# Altium project PWM_Controller.PrjPcb
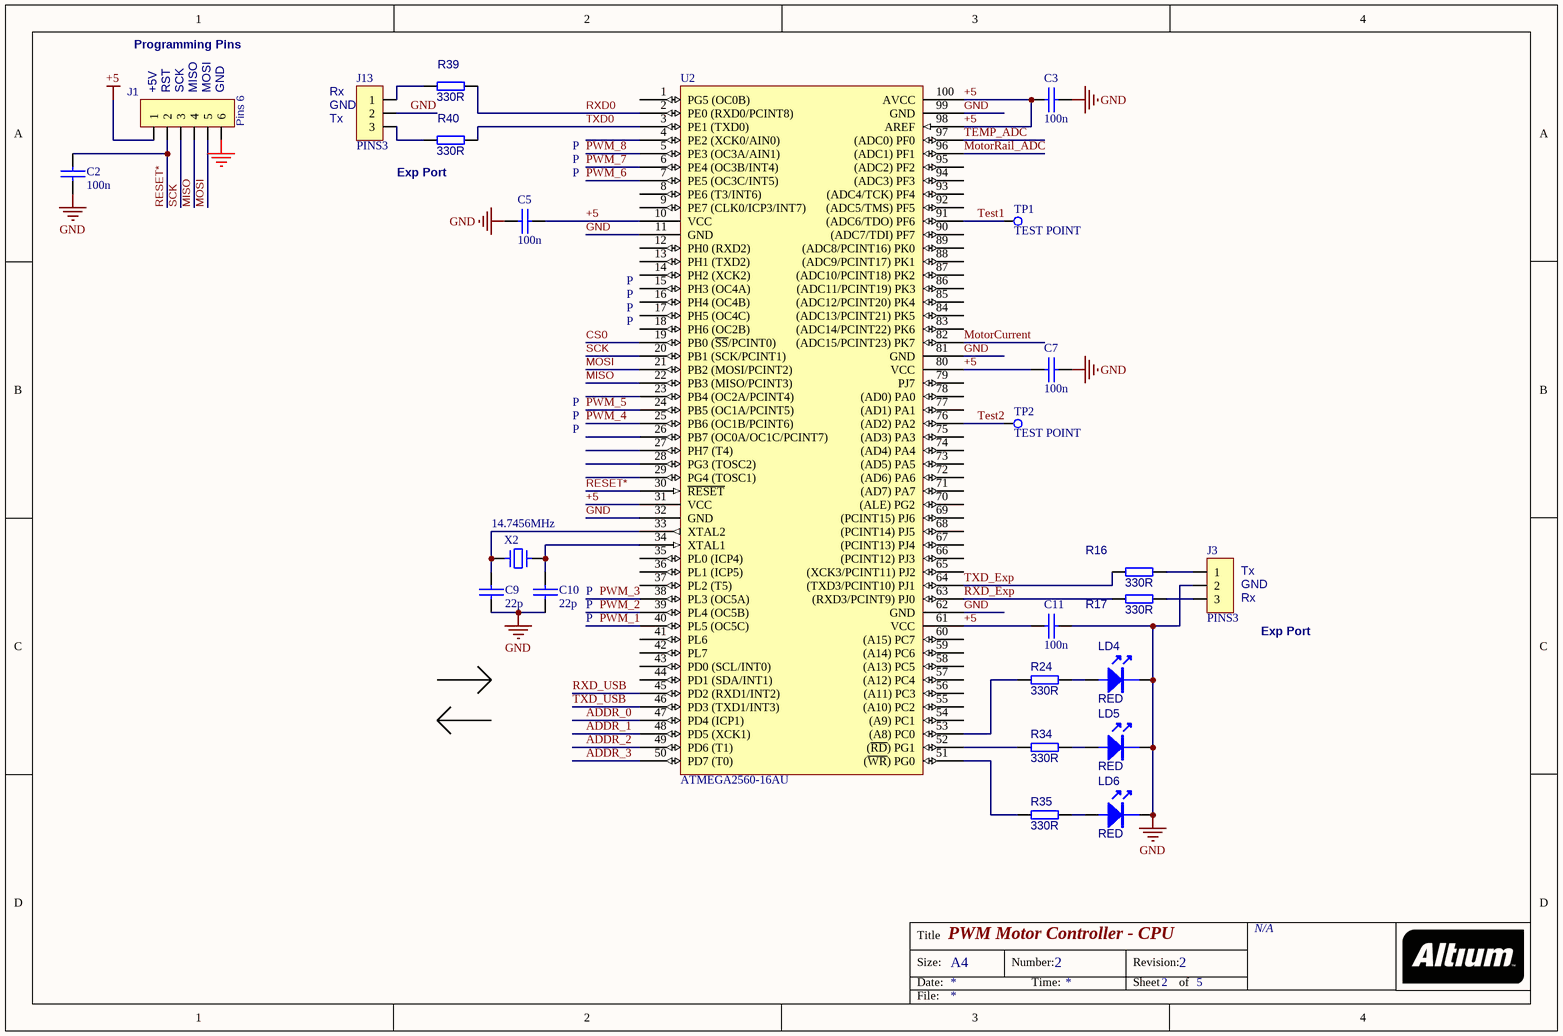
[diagram p0: PWM_CON_CPU.SchDoc]
5 sheets, 119 parts. Net scope: global (net labels, ports and power ports of the same name join across sheets).
Board file: PWM_Controller.PcbDoc
Sheets:
  PWM_CON_CPU.SchDoc
  PWM_CON_Outputs.SchDoc
  PWM_CON_PowerSupply.SchDoc
  PWM_CON_Sensors.SchDoc
  PWM_CON_USB.SchDoc

## Sheet PWM_CON_CPU.SchDoc: PWM Motor Controller - CPU
size A4; DocumentNumber: 2; Revision: 2; SheetNumber: 2; SheetTotal: 5; DrawnBy: T. Burns; Organization: N/A; ProjectName: PWM Motor Controller

### Parts
C2  100n  [0603]
C3  100n  [0603]
C5  100n  [0603]
C7  100n  [0603]
C9  22p  [0603]
C10  22p  [0603]
C11  100n  [0603]
J1  Pins 6  [SIP6]
J3  PINS3  [SIP3]
J13  PINS3  [SIP3]
LD4  RED  [0805DIODE]
LD5  RED  [0805DIODE]
LD6  RED  [0805DIODE]
R16  330R  [0603]
R17  330R  [0603]
R24  330R  [0603]
R34  330R  [0603]
R35  330R  [0603]
R39  330R  [0603]
R40  330R  [0603]
TP1  TEST POINT  [TEST POINT]
TP2  TEST POINT  [TEST POINT]
U2  ATMEGA2560-16AU  [100T1_N]
X2  14.7456MHz  [XTAL-V2]

### Nets
+5: C3.2 C5.1 C7.2 C11.2 J1.1 U2.10(VCC) U2.31(VCC) U2.61(VCC) U2.80(VCC) U2.98(AREF) U2.100(AVCC)
GND: C2.1 C3.1 C5.2 C7.1 C9.2 C10.2 C11.1 J1.6 J3.2 J13.2 LD4.K LD5.K LD6.K U2.11(GND) U2.32(GND) U2.62(GND) U2.81(GND) U2.99(GND)
ADDR_0: U2.47(PD4_(ICP1))
ADDR_1: U2.48(PD5_(XCK1))
ADDR_2: U2.49(PD6_(T1))
ADDR_3: U2.50(PD7_(T0))
CS0: U2.19(PB0_(~{SS}/PCINT0))
MISO: J1.4 U2.22(PB3_(MISO/PCINT3))
MOSI: J1.5 U2.21(PB2_(MOSI/PCINT2))
MotorCurrent: U2.82((ADC15/PCINT23)_PK7)
MotorRail_ADC: U2.96((ADC1)_PF1)
PWM_1: U2.40(PL5_(OC5C))
PWM_2: U2.39(PL4_(OC5B))
PWM_3: U2.38(PL3_(OC5A))
PWM_4: U2.25(PB6_(OC1B/PCINT6))
PWM_5: U2.24(PB5_(OC1A/PCINT5))
PWM_6: U2.7(PE5_(OC3C/INT5))
PWM_7: U2.6(PE4_(OC3B/INT4))
PWM_8: U2.5(PE3_(OC3A/AIN1))
RESET*: C2.2 J1.2 U2.30(~{RESET})
RXD0: R39.2 U2.2(PE0_(RXD0/PCINT8))
RXD_Exp: R17.1 U2.63((RXD3/PCINT9)_PJ0)
RXD_USB: U2.45(PD2_(RXD1/INT2))
SCK: J1.3 U2.20(PB1_(SCK/PCINT1))
TEMP_ADC: U2.97((ADC0)_PF0)
Test1: TP1.1 U2.91((ADC6/TDO)_PF6)
Test2: TP2.1 U2.76((AD2)_PA2)
TXD0: R40.2 U2.3(PE1_(TXD0))
TXD_Exp: R16.1 U2.64((TXD3/PCINT10)_PJ1)
TXD_USB: U2.46(PD3_(TXD1/INT3))
NetC9_1: C9.1 U2.33(XTAL2) X2.2
NetC10_1: C10.1 U2.34(XTAL1) X2.1
NetJ3_1: J3.1 R16.2
NetJ3_3: J3.3 R17.2
NetJ13_1: J13.1 R39.1
NetJ13_3: J13.3 R40.1
NetLD4_A: LD4.A R24.2
NetLD5_A: LD5.A R34.2
NetLD6_A: LD6.A R35.2
NetR24_1: R24.1 U2.53((A8)_PC0)
NetR34_1: R34.1 U2.52((~{RD})_PG1)
NetR35_1: R35.1 U2.51((~{WR})_PG0)

Not connected (* = marked no-connect by the designer): U2 1(PG5_(OC0B)) 4(PE2_(XCK0/AIN0)) 8(PE6_(T3/INT6)) 9(PE7_(CLK0/ICP3/INT7)) 12(PH0_(RXD2)) 13(PH1_(TXD2)) 14(PH2_(XCK2)) 15(PH3_(OC4A)) 16(PH4_(OC4B)) 17(PH5_(OC4C)) 18(PH6_(OC2B)) 23(PB4_(OC2A/PCINT4)) 26(PB7_(OC0A/OC1C/PCINT7)) 27(PH7_(T4)) 28(PG3_(TOSC2)) 29(PG4_(TOSC1)) 35(PL0_(ICP4)) 36(PL1_(ICP5)) 37(PL2_(T5)) 41(PL6) 42(PL7) 43(PD0_(SCL/INT0)) 44(PD1_(SDA/INT1)) 54((A9)_PC1) 55((A10)_PC2) 56((A11)_PC3) 57((A12)_PC4) 58((A13)_PC5) 59((A14)_PC6) 60((A15)_PC7) 65((XCK3/PCINT11)_PJ2) 66((PCINT12)_PJ3) 67((PCINT13)_PJ4) 68((PCINT14)_PJ5) 69((PCINT15)_PJ6) 70((ALE)_PG2) 71((AD7)_PA7) 72((AD6)_PA6) 73((AD5)_PA5) 74((AD4)_PA4) 75((AD3)_PA3) 77((AD1)_PA1) 78((AD0)_PA0) 79(PJ7) 83((ADC14/PCINT22)_PK6) 84((ADC13/PCINT21)_PK5) 85((ADC12/PCINT20)_PK4) 86((ADC11/PCINT19)_PK3) 87((ADC10/PCINT18)_PK2) 88((ADC9/PCINT17)_PK1) 89((ADC8/PCINT16)_PK0) 90((ADC7/TDI)_PF7) 92((ADC5/TMS)_PF5) 93((ADC4/TCK)_PF4) 94((ADC3)_PF3) 95((ADC2)_PF2)

### Notes on the sheet
- Programming Pins
- (near J1) +5V
- (near J1) RST
- (near J1) SCK
- (near J1) MISO
- (near J1) MOSI
- (near J1) GND
- (near J13) Rx
- (near J13) GND
- (near J13) Tx
- Exp Port
- P
- (near U2) P
- (near J3) Tx
- (near C10) P
- (near J3) Rx
- (near J3) GND
- (near J3) Exp Port
- Title
- Size:
- Date:
- A4
- Number:
- Time:
- Revision:
- Sheet
- of
- File:

### Library data of the parts
C2 C3 C5 C7 C11 = CAP: PartNo: R8835; Supplier: Altronics
C9 C10 = CAP: PartNo: R8736; Supplier: Altronics
J1 = CON6: PartNo: P5430; Supplier: Altronics
J3 J13 = CON3: PartNo: P5430; Supplier: Altronics
LD4-LD6 = LED: PartNo: Y1107; Supplier: Altronics
R16 R17 R24 R34 R35 R39 R40 = RES8: PartNo: R1560; Supplier: Element14
TP1 TP2 = TEST POINT: Probe compatible test point
U2 = ATMEGA2560(TQFP100): PartNo: 1288330; Supplier: Element14
X2 = CRYSTAL: PartNo: 1640874; Supplier: Element14

## Sheet PWM_CON_Outputs.SchDoc: PWM Motor Controller -  Ouputs
size A4; DocumentNumber: 3; Revision: 2; SheetNumber: 3; SheetTotal: 5; DrawnBy: T. Burns; Organization: N/A; ProjectName: PWM Motor Controller
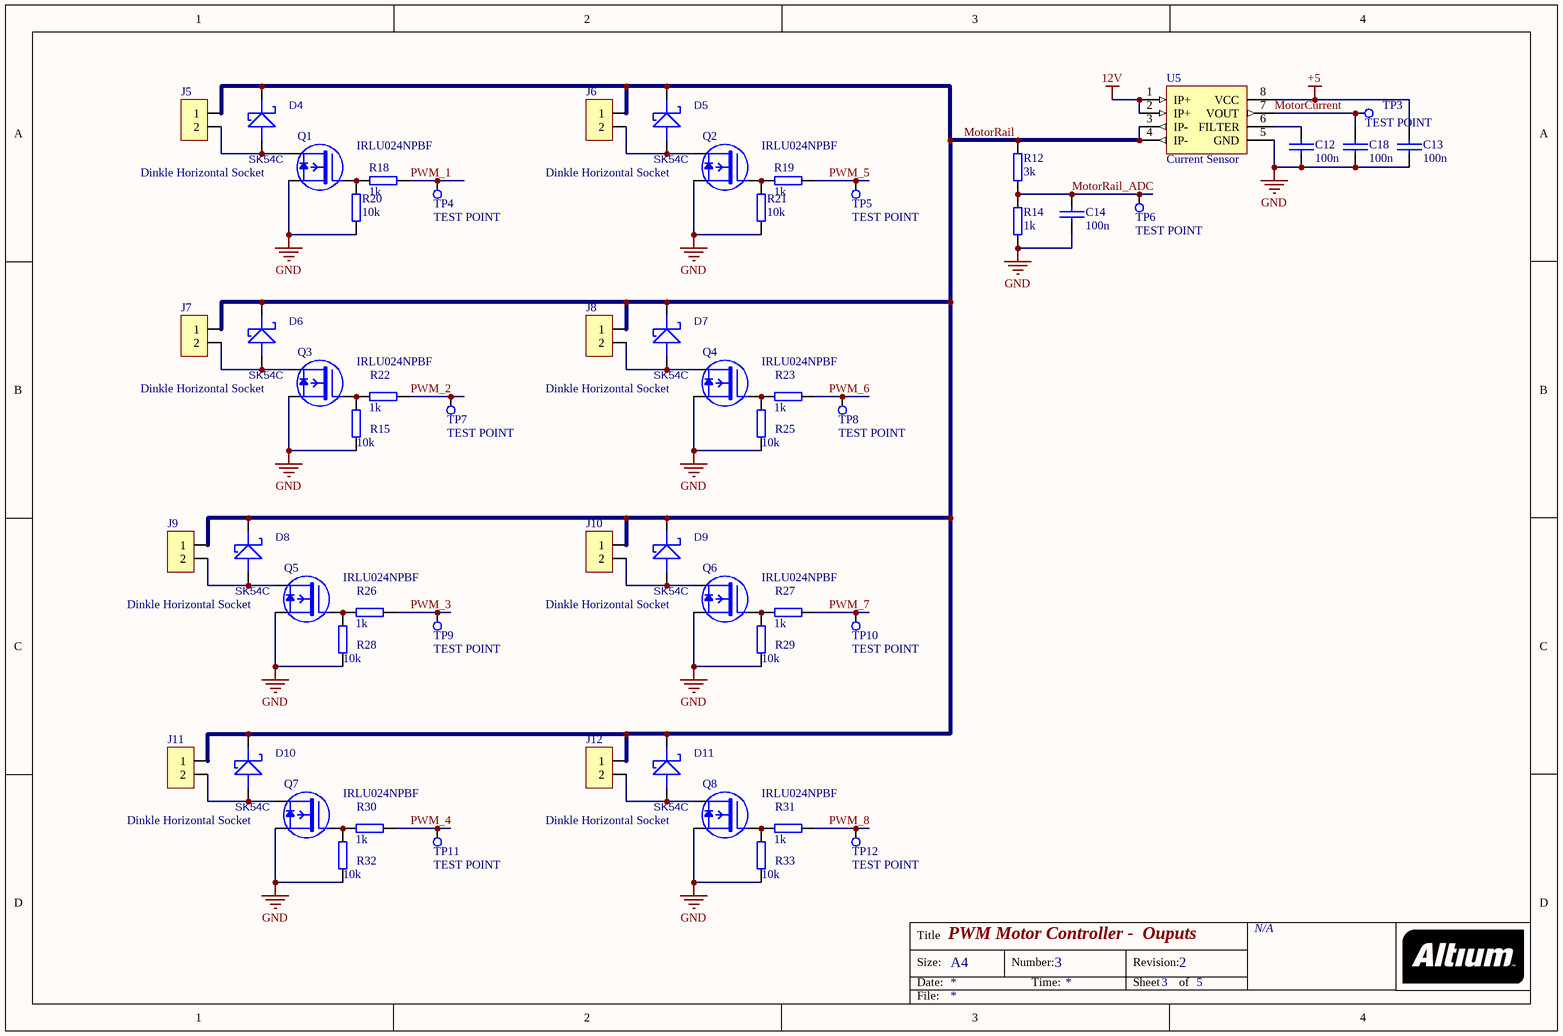
[diagram p1: PWM_CON_Outputs.SchDoc]

### Parts
C12  100n  [0603]
C13  100n  [0603]
C14  100n  [0603]
C18  100n  [0603]
D4  SK54C  [SMC]
D5  SK54C  [SMC]
D6  SK54C  [SMC]
D7  SK54C  [SMC]
D8  SK54C  [SMC]
D9  SK54C  [SMC]
D10  SK54C  [SMC]
D11  SK54C  [SMC]
J5  Dinkle Horizontal Socket  [WEID2R]
J6  Dinkle Horizontal Socket  [WEID2R]
J7  Dinkle Horizontal Socket  [WEID2R]
J8  Dinkle Horizontal Socket  [WEID2R]
J9  Dinkle Horizontal Socket  [WEID2R]
J10  Dinkle Horizontal Socket  [WEID2R]
J11  Dinkle Horizontal Socket  [WEID2R]
J12  Dinkle Horizontal Socket  [WEID2R]
Q1  IRLU024NPBF  [TO-251]
Q2  IRLU024NPBF  [TO-251]
Q3  IRLU024NPBF  [TO-251]
Q4  IRLU024NPBF  [TO-251]
Q5  IRLU024NPBF  [TO-251]
Q6  IRLU024NPBF  [TO-251]
Q7  IRLU024NPBF  [TO-251]
Q8  IRLU024NPBF  [TO-251]
R12  3k  [0603]
R14  1k  [0603]
R15  10k  [0603]
R18  1k  [0603]
R19  1k  [0603]
R20  10k  [0603]
R21  10k  [0603]
R22  1k  [0603]
R23  1k  [0603]
R25  10k  [0603]
R26  1k  [0603]
R27  1k  [0603]
R28  10k  [0603]
R29  10k  [0603]
R30  1k  [0603]
R31  1k  [0603]
R32  10k  [0603]
R33  10k  [0603]
TP3  TEST POINT  [TEST POINT]
TP4  TEST POINT  [TEST POINT]
TP5  TEST POINT  [TEST POINT]
TP6  TEST POINT  [TEST POINT]
TP7  TEST POINT  [TEST POINT]
TP8  TEST POINT  [TEST POINT]
TP9  TEST POINT  [TEST POINT]
TP10  TEST POINT  [TEST POINT]
TP11  TEST POINT  [TEST POINT]
TP12  TEST POINT  [TEST POINT]
U5  Current Sensor  [so-8]

### Nets
12V: U5.1(IP+) U5.2(IP+)
+5: C13.2 U5.8(VCC)
GND: C12.1 C13.1 C14.1 C18.1 Q1.S Q2.S Q3.S Q4.S Q5.S Q6.S Q7.S Q8.S R14.2 R15.1 R20.1 R21.1 R25.1 R28.1 R29.1 R32.1 R33.1 U5.5(GND)
MotorCurrent: C18.2 TP3.1 U5.7(VOUT)
MotorRail: D4.K D5.K D6.K D7.K D8.K D9.K D10.K D11.K J5.1 J6.1 J7.1 J8.1 J9.1 J10.1 J11.1 J12.1 R12.2 U5.3(IP-) U5.4(IP-)
MotorRail_ADC: C14.2 R12.1 R14.1 TP6.1
PWM_1: R18.1 TP4.1
PWM_2: R22.1 TP7.1
PWM_3: R26.1 TP9.1
PWM_4: R30.1 TP11.1
PWM_5: R19.1 TP5.1
PWM_6: R23.1 TP8.1
PWM_7: R27.1 TP10.1
PWM_8: R31.1 TP12.1
NetC12_2: C12.2 U5.6(FILTER)
NetD4_A: D4.A J5.2 Q1.D
NetD5_A: D5.A J6.2 Q2.D
NetD6_A: D6.A J7.2 Q3.D
NetD7_A: D7.A J8.2 Q4.D
NetD8_A: D8.A J9.2 Q5.D
NetD9_A: D9.A J10.2 Q6.D
NetD10_A: D10.A J11.2 Q7.D
NetD11_A: D11.A J12.2 Q8.D
NetQ1_G: Q1.G R18.2 R20.2
NetQ2_G: Q2.G R19.2 R21.2
NetQ3_G: Q3.G R15.2 R22.2
NetQ4_G: Q4.G R23.2 R25.2
NetQ5_G: Q5.G R26.2 R28.2
NetQ6_G: Q6.G R27.2 R29.2
NetQ7_G: Q7.G R30.2 R32.2
NetQ8_G: Q8.G R31.2 R33.2

### Notes on the sheet
- Title
- Size:
- Date:
- A4
- Number:
- Time:
- Revision:
- Sheet
- of
- File:

### Library data of the parts
C12-C14 C18 = CAP: PartNo: R8835; Supplier: Altronics
D4-D11 = DIODE SCHOTTKY: PartNo: 1299291; Supplier: Element14
J5-J12 = CON2: PartNo: P2552; Supplier: Altronics
Q1-Q8 = MOSFET-N1DSML: N Channel MOSFET; PartNo: 8651329; Manuf: INTERNATIONAL RECTIFIER; Id: 17A; Vds: 55V; PowerDisp: 46W; Supplier: Element14
R12 = RES8: 1% Resistor; PartNo: R1629; Supplier: Altronics
R14 R18 R19 R22 R23 R26 R27 R30 R31 = RES8: 1% Resistor; PartNo: R1596; Supplier: Altronics
R15 R20 R21 R25 R28 R29 R32 R33 = RES8: 1% Resistor; PartNo: R1668; Supplier: Altronics
TP3-TP12 = TEST POINT: Probe compatible test point
U5 = ACS714: +/- XA Current Sensor; Supplier: Digi-key

## Sheet PWM_CON_PowerSupply.SchDoc: PWM Motor Controller - Power Supply
size A4; DocumentNumber: 1; Revision: 2; SheetNumber: 1; SheetTotal: 4; DrawnBy: T. Burns; Organization: N/A; ProjectName: PWM Motor Controller
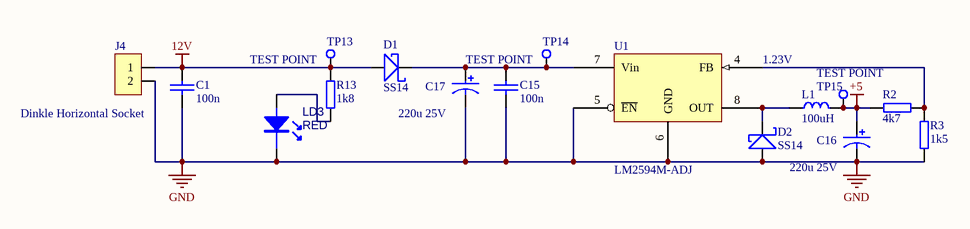
[diagram p2: PWM_CON_PowerSupply.SchDoc]

### Parts
C1  100n  [0603]
C15  100n  [0603]
C16  220u 25V  [RB.15/.32]
C17  220u 25V  [RB.15/.32]
D1  SS14  [DO-214AC]
D2  SS14  [DO-214AC]
J4  Dinkle Horizontal Socket  [WEID2R]
L1  100uH  [INDUCTOR6B]
LD3  RED  [0805DIODE]
R2  4k7  [0603]
R3  1k5  [0603]
R13  1k8  [0603]
TP13  TEST POINT  [TEST POINT]
TP14  TEST POINT  [TEST POINT]
TP15  TEST POINT  [TEST POINT]
U1  LM2594M-ADJ  [M08A_N]

### Nets
12V: C1.2 D1.A J4.1 R13.1 TP13.1
+5: C16.1 L1.2 R2.1 TP15.1
GND: C1.1 C15.1 C16.2 C17.2 D2.A J4.2 LD3.K R3.2 U1.5(~{EN}) U1.6(GND)
NetC15_2: C15.2 C17.1 D1.K TP14.1 U1.7(Vin)
NetD2_K: D2.K L1.1 U1.8(OUT)
NetLD3_A: LD3.A R13.2
NetR2_2: R2.2 R3.1 U1.4(FB)

### Notes on the sheet
- 1.23V
- Title
- Size:
- Date:
- A4
- Number:
- Time:
- Revision:
- Sheet
- of
- File:

### Library data of the parts
C1 C15 = CAP: PartNo: R8835; Supplier: Altronics
C16 C17 = CAPACITOR POL-S: PartNo: R5144; Supplier: Altronics
D1 D2 = DIODE SCHOTTKY-S: SCHOTTKY , 1A, 40V; PartNo: 4085159; Supplier: Element14; Repetitive Reverse Voltage: 40V; Forward Current: 1A
J4 = CON2: PartNo: P2552; Supplier: Altronics
L1 = INDUCTOR6: 0.5A Inductor; PartNo: L6222; Supplier: Altronics
LD3 = LED: PartNo: Y1107; Supplier: Altronics
R2 = RES8: 1% Resistor; PartNo: R1644; Supplier: Altronics
R3 = RES8: 1% Resistor; PartNo: R1608; Supplier: Altronics
R13 = RES8: 1% Resistor; PartNo: R1614; Supplier: Altronics
TP13-TP15 = TEST POINT: Probe compatible test point
U1 = LM2594: SMPS 0.5A; PartNo: 9494332; Vin - Min: 40; Vin - Max: 4.5; Out Current: 500mA; Freq: 150KHz; Supplier: Element14

## Sheet PWM_CON_Sensors.SchDoc: PWM Motor Controller - Sensors
size A4; Author: T. Burns; Revision: 3; SheetNumber: 4; SheetTotal: 5; DrawnBy: Thomas Burns; Organization: N/A; ProjectName: PWM Motor Controller
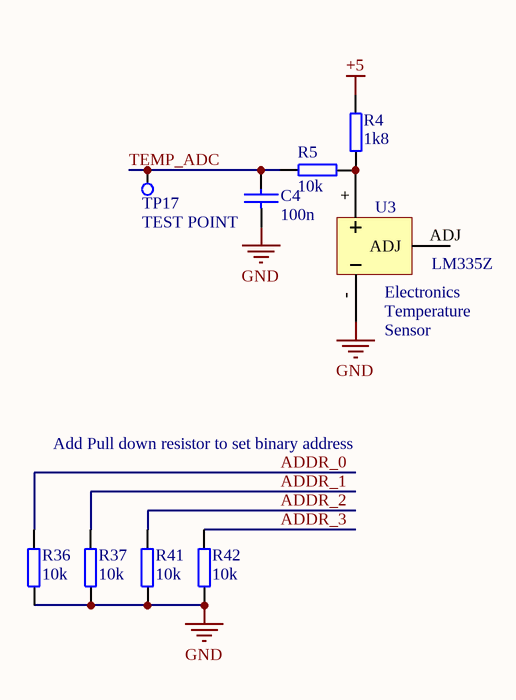
[diagram p3: PWM_CON_Sensors.SchDoc]

### Parts
C4  100n  [0603]
R4  1k8  [0603]
R5  10k  [0603]
R36  10k  [0603]
R37  10k  [0603]
R41  10k  [0603]
R42  10k  [0603]
TP17  TEST POINT  [TEST POINT]
U3  LM335Z  [TO-92_LM335]

### Nets
+5: R4.1
GND: C4.1 R36.1 R37.1 R41.1 R42.1 U3.-
ADDR_0: R36.2
ADDR_1: R37.2
ADDR_2: R41.2
ADDR_3: R42.2
TEMP_ADC: C4.2 R5.2 TP17.1
NetR4_2: R4.2 R5.1 U3.+

Not connected (* = marked no-connect by the designer): U3 ADJ

### Notes on the sheet
- (near U3) Electronics
- (near U3) Temperature
- (near U3) Sensor
- Add Pull down resistor to set binary address
- Title
- Size:
- Date:
- A4
- Number:
- Time:
- Revision:
- Sheet
- of
- File:

### Library data of the parts
C4 = CAP: PartNo: R8835; Supplier: Altronics
R4 = RES8: 1% Resistor; PartNo: R1614; Supplier: Altronics
R5 R36 R37 R41 R42 = RES8: 1% Resistor; PartNo: R1668; Supplier: Altronics
TP17 = TEST POINT: Probe compatible test point
U3 = LM335Z: PartNo: Z2530; Supplier: Altronics

## Sheet PWM_CON_USB.SchDoc: PWM Motor Controller - USB
size A4; Author: T. Burns; DocumentNumber: 5; Revision: 3; SheetNumber: 5; SheetTotal: 5; DrawnBy: Thomas Burns; Organization: N/A; ProjectName: PWM Motor Controller
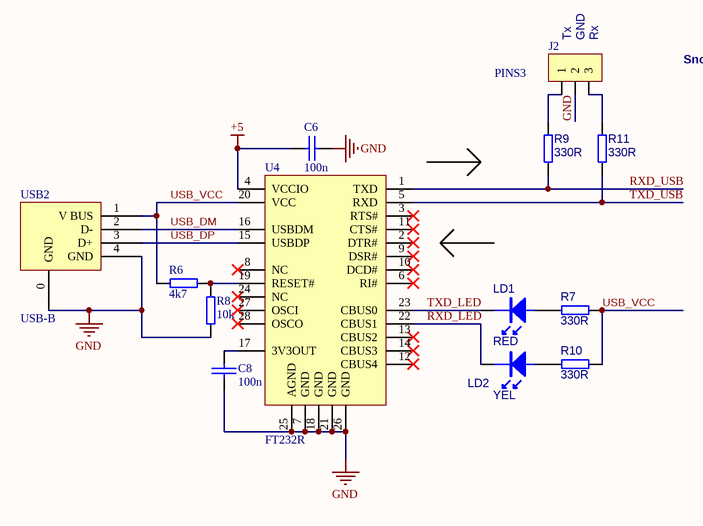
[diagram p4: PWM_CON_USB.SchDoc]

### Parts
C6  100n  [0603]
C8  100n  [0603]
J2  PINS3  [SIP3]
LD1  RED  [0805DIODE]
LD2  YEL  [0805DIODE]
R6  4k7  [0603]
R7  330R  [0603]
R8  10k  [0603]
R9  330R  [0603]
R10  330R  [0603]
R11  330R  [0603]
U4  FT232R  [ssop28]
USB2  USB-B  [USB_BV]

### Nets
+5: C6.2 U4.4(VCCIO)
GND: C6.1 C8.1 J2.2 R8.1 U4.7(GND) U4.18(GND) U4.21(GND) U4.25(AGND) U4.26(GND) USB2.0(GND) USB2.4(GND)
RXD_LED: LD2.K U4.22(CBUS1)
RXD_USB: R9.2 U4.1(TXD)
TXD_LED: LD1.K U4.23(CBUS0)
TXD_USB: R11.2 U4.5(RXD)
USB_DM: U4.16(USBDM) USB2.2(D-)
USB_DP: U4.15(USBDP) USB2.3(D+)
USB_VCC: R6.1 R7.1 R10.1 U4.20(VCC) USB2.1(V_BUS)
NetC8_2: C8.2 U4.17(3V3OUT)
NetJ2_1: J2.1 R9.1
NetJ2_3: J2.3 R11.1
NetLD1_A: LD1.A R7.2
NetLD2_A: LD2.A R10.2
NetR6_2: R6.2 R8.2 U4.19(RESET#)

Not connected (* = marked no-connect by the designer): U4 2(DTR#)* 3(RTS#)* 6(RI#)* 8(NC)* 9(DSR#)* 10(DCD#)* 11(CTS#)* 12(CBUS4)* 13(CBUS2)* 14(CBUS3)* 24(NC)* 27(OSCI)* 28(OSCO)*

### Notes on the sheet
- (near J2) Tx
- (near J2) GND
- (near J2) Rx
- Snoop
- Title
- Size:
- Date:
- A4
- Number:
- Time:
- Revision:
- Sheet
- of
- File:

### Library data of the parts
C6 C8 = CAP: PartNo: R8835; Supplier: Altronics
J2 = CON3: PartNo: P5430; Supplier: Altronics
LD1 = LED: PartNo: Y1107; Supplier: Altronics
LD2 = LED: PartNo: Y1116; Supplier: Altronics
R6 = RES8: 1% Resistor; PartNo: R1644; Supplier: Altronics
R7 R9-R11 = RES8: PartNo: R1560; Supplier: Element14
R8 = RES8: 1% Resistor; PartNo: R1668; Supplier: Altronics
U4 = FT232R: FTDI USB - USART; PartNo: 1146032RL; Supplier: Element14
USB2 = USB-B: PartNo: 1177884; Supplier: Element14

## Nets that join several sheets
12V: PWM_CON_Outputs (U5.1 U5.2), PWM_CON_PowerSupply (5 pins)
+5: PWM_CON_CPU (11 pins), PWM_CON_Outputs (C13.2 U5.8), PWM_CON_PowerSupply (C16.1 L1.2 R2.1 TP15.1), PWM_CON_Sensors (R4.1), PWM_CON_USB (C6.2 U4.4)
GND: PWM_CON_CPU (18 pins), PWM_CON_Outputs (22 pins), PWM_CON_PowerSupply (10 pins), PWM_CON_Sensors (6 pins), PWM_CON_USB (11 pins)
ADDR_0: PWM_CON_CPU (U2.47), PWM_CON_Sensors (R36.2)
ADDR_1: PWM_CON_CPU (U2.48), PWM_CON_Sensors (R37.2)
ADDR_2: PWM_CON_CPU (U2.49), PWM_CON_Sensors (R41.2)
ADDR_3: PWM_CON_CPU (U2.50), PWM_CON_Sensors (R42.2)
MotorCurrent: PWM_CON_CPU (U2.82), PWM_CON_Outputs (C18.2 TP3.1 U5.7)
MotorRail_ADC: PWM_CON_CPU (U2.96), PWM_CON_Outputs (C14.2 R12.1 R14.1 TP6.1)
PWM_1: PWM_CON_CPU (U2.40), PWM_CON_Outputs (R18.1 TP4.1)
PWM_2: PWM_CON_CPU (U2.39), PWM_CON_Outputs (R22.1 TP7.1)
PWM_3: PWM_CON_CPU (U2.38), PWM_CON_Outputs (R26.1 TP9.1)
PWM_4: PWM_CON_CPU (U2.25), PWM_CON_Outputs (R30.1 TP11.1)
PWM_5: PWM_CON_CPU (U2.24), PWM_CON_Outputs (R19.1 TP5.1)
PWM_6: PWM_CON_CPU (U2.7), PWM_CON_Outputs (R23.1 TP8.1)
PWM_7: PWM_CON_CPU (U2.6), PWM_CON_Outputs (R27.1 TP10.1)
PWM_8: PWM_CON_CPU (U2.5), PWM_CON_Outputs (R31.1 TP12.1)
RXD_USB: PWM_CON_CPU (U2.45), PWM_CON_USB (R9.2 U4.1)
TEMP_ADC: PWM_CON_CPU (U2.97), PWM_CON_Sensors (C4.2 R5.2 TP17.1)
TXD_USB: PWM_CON_CPU (U2.46), PWM_CON_USB (R11.2 U4.5)